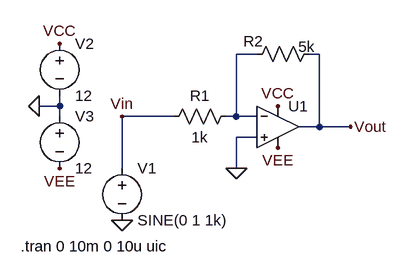
[diagram p0: schematic OpAmp_Circuit.asc]
OpAmp_Circuit.asc, the LTspice schematic file:
Version 4
SHEET 1 880 680
WIRE 288 112 256 112
WIRE 384 112 368 112
WIRE -16 192 -16 176
WIRE -16 192 -48 192
WIRE -16 208 -16 192
WIRE 160 208 80 208
WIRE 256 208 256 112
WIRE 256 208 240 208
WIRE 288 208 256 208
WIRE 384 224 384 112
WIRE 384 224 352 224
WIRE 432 224 384 224
WIRE 288 240 256 240
WIRE 80 288 80 208
WIRE 256 288 256 240
FLAG 80 368 0
FLAG 256 288 0
FLAG -48 192 0
FLAG -16 96 VCC
FLAG -16 288 VEE
FLAG 320 256 VEE
FLAG 320 192 VCC
FLAG 432 224 Vout
FLAG 80 208 Vin
SYMBOL voltage 80 272 R0
WINDOW 123 0 0 Left 0
WINDOW 39 0 0 Left 0
SYMATTR InstName V1
SYMATTR Value SINE(0 1 1k)
SYMBOL res 256 192 R90
WINDOW 0 0 56 VBottom 2
WINDOW 3 32 56 VTop 2
SYMATTR InstName R1
SYMATTR Value 1k
SYMBOL res 384 96 R90
WINDOW 0 12 102 VBottom 2
WINDOW 3 -11 20 VTop 2
SYMATTR InstName R2
SYMATTR Value 5k
SYMBOL Opamps\\UniversalOpamp2 320 224 R0
SYMATTR InstName U1
SYMBOL voltage -16 80 R0
SYMATTR InstName V2
SYMATTR Value 12
SYMBOL voltage -16 192 R0
SYMATTR InstName V3
SYMATTR Value 12
TEXT -76 408 Left 2 !.tran 0 10m 0 10u uic

The netlist it stands for:
* OpAmp_Circuit.asc
V1 Vin 0 SINE(0 1 1k)
R1 N001 Vin 1k
R2 Vout N001 5k
XU1 0 N001 VCC VEE Vout level.2 Avol=1Meg GBW=10Meg Slew=10Meg ilimit=25m rail=0 Vos=0 phimargin=45 en=0 enk=0 in=0 ink=0 Rin=500Meg  ; pins IN+ IN- V+ V- OUT
V2 VCC 0 12
V3 0 VEE 12
.tran 0 10m 0 10u uic
.lib UniversalOpamps2.sub
.backanno
.end